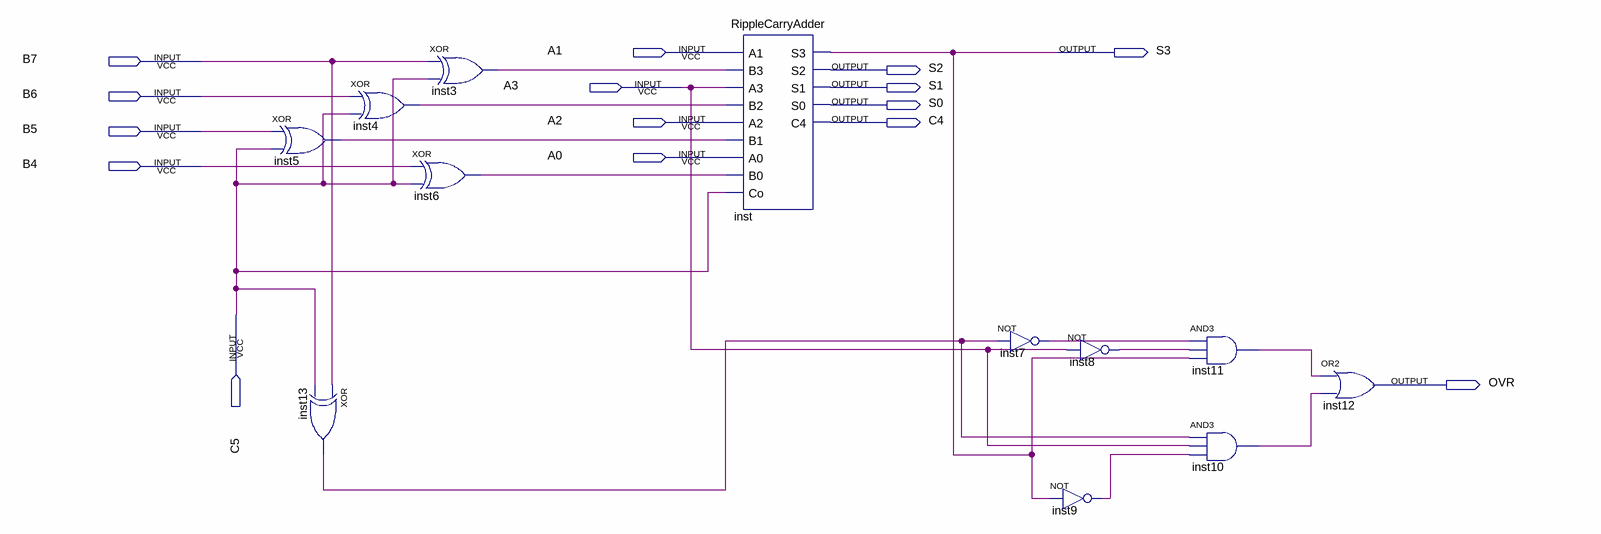
[diagram p0: schematic sheet]
// Quartus schematic AdderSubtractorOVR.bdf as structural Verilog: 12 symbols, 15 pins
module AdderSubtractorOVR (
  input  A1,
  input  B7,
  input  A3,
  input  B6,
  input  A2,
  input  B5,
  input  A0,
  input  B4,
  input  C5,
  output S3,
  output S2,
  output S1,
  output S0,
  output C4,
  output OVR
);

  wire inst3_out, inst4_out, inst5_out, inst6_out, inst7_out, inst8_out, inst9_out, inst10_out, inst11_out,
       inst13_out;

  xor inst5 (inst5_out, B5, C5);
  xor inst13 (inst13_out, B7, C5);
  xor inst4 (inst4_out, B6, C5);
  xor inst3 (inst3_out, B7, C5);
  xor inst6 (inst6_out, B4, C5);
  RippleCarryAdder inst (
    .A1(A1), .B3(inst3_out), .A3(A3), .B2(inst4_out), .A2(A2), .B1(inst5_out), .A0(A0), .B0(inst6_out),
    .Co(C5), .S3(S3), .S2(S2), .S1(S1), .S0(S0), .C4(C4));
  not inst7 (inst7_out, inst13_out);
  not inst8 (inst8_out, A3);
  not inst9 (inst9_out, S3);
  and inst11 (inst11_out, inst7_out, inst8_out, S3);
  and inst10 (inst10_out, inst13_out, A3, inst9_out);
  or inst12 (OVR, inst11_out, inst10_out);
endmodule
